# Altium schematic sheet battery-charging.SchDoc
size A
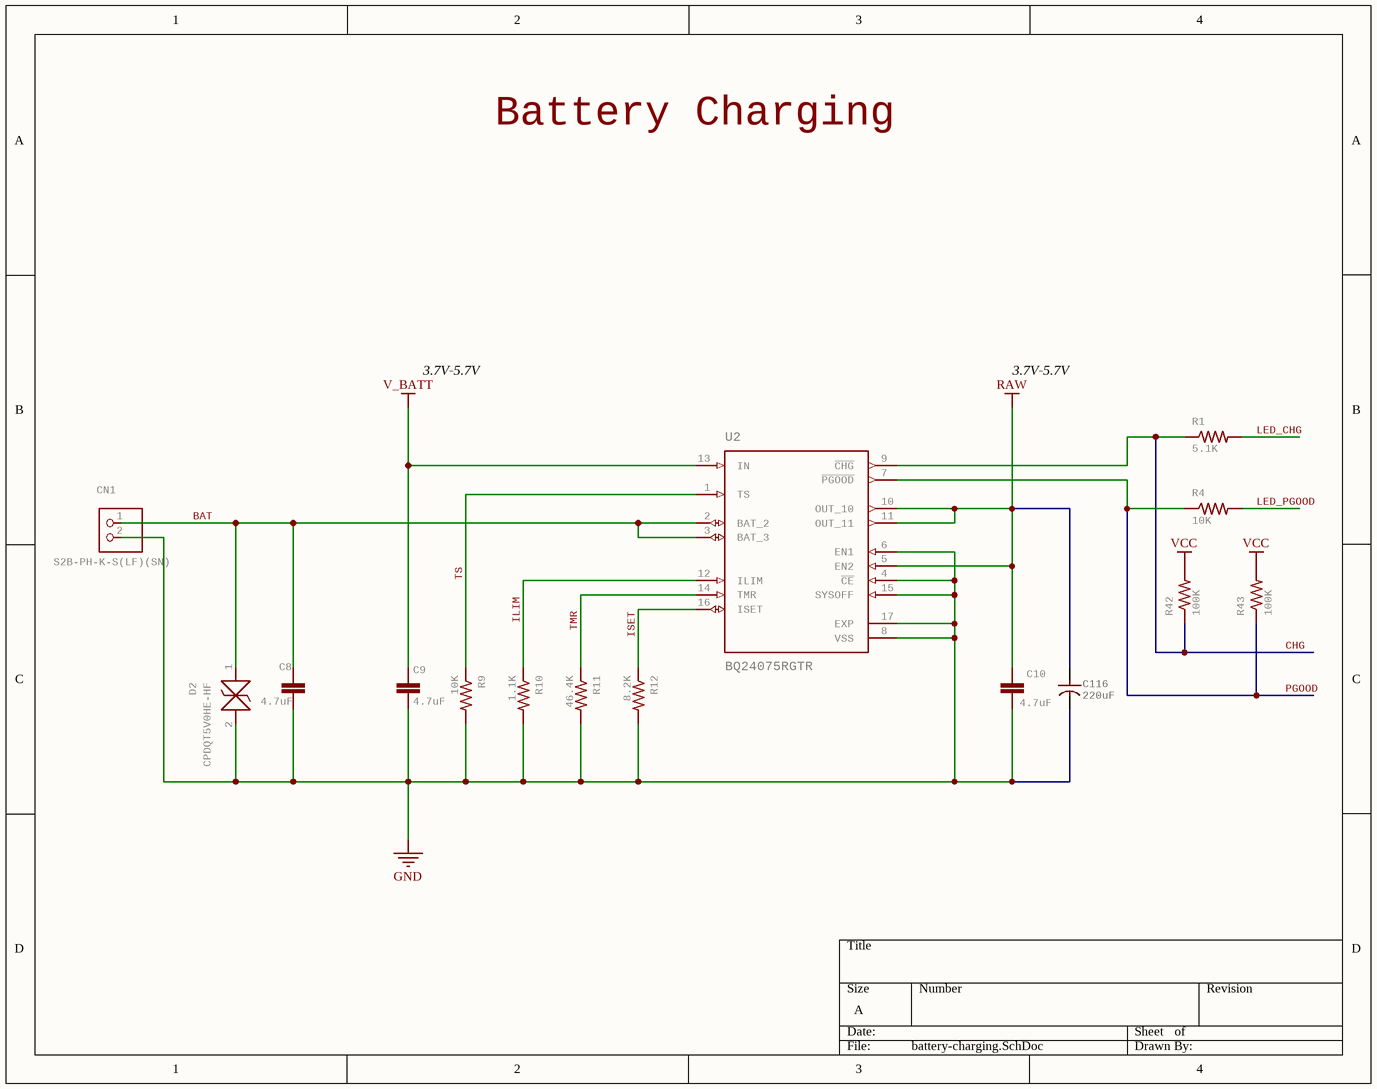
[diagram p0: battery-charging.SchDoc]

## Parts
C8  4.7uF  [0402-CAP]
C9  4.7uF  [0402-CAP]
C10  4.7uF  [0402-CAP]
C116  220uF  [CAP-TANT-1411]
CN1  S2B-PH-K-S(LF)(SN)  [JST-PH-2-THM-RA]
D2  CPDQT5V0HE-HF  [CPDQT5V0HEHF]
R1  5.1K  [0402-RES]
R4  10K  [0402-RES]
R9  10K  [0402-RES]
R10  1.1K  [0402-RES]
R11  46.4K  [0402-RES]
R12  8.2K  [0402-RES]
R42  100K  [0402-RES]
R43  100K  [0402-RES]
U2  BQ24075RGTR  [QFN50P300X300X100-17N]

## Nets
GND: C8.1 C9.1 C10.1 C116.2 CN1.2 D2.2 R9.2 R10.2 R11.2 R12.2 U2.4(~{CE}) U2.6(EN1) U2.8(VSS) U2.15(SYSOFF) U2.17(EXP)
RAW: C10.2 C116.1 U2.5(EN2) U2.10(OUT_10) U2.11(OUT_11)
V_BATT: C9.2 U2.13(IN)
VCC: R42.2 R43.2
BAT: C8.2 CN1.1 D2.1 U2.2(BAT_2) U2.3(BAT_3)
CHG: R1.1 R42.1 U2.9(~{CHG})
ILIM: R10.1 U2.12(ILIM)
ISET: R12.1 U2.16(ISET)
LED_CHG: R1.2
LED_PGOOD: R4.2
PGOOD: R4.1 R43.1 U2.7(~{PGOOD})
TMR: R11.1 U2.14(TMR)
TS: R9.1 U2.1(TS)

## Notes on the sheet
- Battery Charging
- 3.7V-5.7V

## Library data of the parts
C8-C10 = CAP0402-CAP: CapacitorStandard 0603 ceramic capacitor, and 0.1" leaded capacitor.; MPN: JMK105BBJ475MV-F; GateName_1: G$1; SymbolName_1: CAP; DeviceName: 0402-CAP; LibraryName: sfe; DeviceSetName: CAP; Part Number: JMK105BBJ475MV-F
C116 = CAP_POL: MANUFACTURER P/N: F930J227MBA; Part Number: F930J227MBA; DISTRIBUTOR: *; DISTRIBUTOR P/N: *; Value: 220uF; Parameter 1: *; MPN: F930J227MBA
CN1 = JST_2PIN-THM-RA: JST 2-Pin Connectors of various flavors SMT-RA (S2B-PH-SM4) 4UConnector #17311  SMT  (B2B-PH-SM4)  THM-RA (S2B-PH)  THM  (B2B-PH); GateName_1: G$1; SymbolName_1: PINHD2; DeviceName: -THM-RA; LibraryName: adafruit-updated; DeviceSetName: JST_2PIN; MPN: S2B-PH-K-S(LF)(SN); Part Number: S2B-PH-K-S(LF)(SN)
D2 = CPDQT5V0HE-HF: ESD Suppressors / TVS Diodes DIODE ESD 5VWM 65W 0402/SOD-923F   Source:  Datasheet; MANUFACTURER_NAME: Comchip Technology; GateName_1: G$1; SymbolName_1: CPDQT5V0HE-HF; LibraryName: CPDQT5V0HE-HF; DeviceSetName: CPDQT5V0HE-HF; HEIGHT: 0.42mm; MANUFACTURER_PART_NUMBER: CPDQT5V0HE-HF; MOUSER_PART_NUMBER: MOUSER_PART_NUMBER; MOUSER_PRICE-STOCK: MOUSER_PRICE-STOCK; MPN: CPDQT5V0HE-HF; Part Number: CPDQT5V0HE-HF
R1 = RESISTOR0402-RES: ResistorBasic schematic elements and footprints for 0603, 1206, and PTH resistors.; MPN: RC0402JR-075K1L; GateName_1: G$1; SymbolName_1: RESISTOR; DeviceName: 0402-RES; LibraryName: sfe; DeviceSetName: RESISTOR; Part Number: RC0402JR-075K1L
R4 R9 = RESISTOR0402-RES: ResistorBasic schematic elements and footprints for 0603, 1206, and PTH resistors.; MPN: AC0402FR-1310KL; GateName_1: G$1; SymbolName_1: RESISTOR; DeviceName: 0402-RES; LibraryName: sfe; DeviceSetName: RESISTOR; Part Number: AC0402FR-1310KL
R10 = RESISTOR0402-RES: ResistorBasic schematic elements and footprints for 0603, 1206, and PTH resistors.; MPN: RC0402JR-071K1; GateName_1: G$1; SymbolName_1: RESISTOR; DeviceName: 0402-RES; LibraryName: sfe; DeviceSetName: RESISTOR; Part Number: RC0402JR-071K1
R11 = RESISTOR0402-RES: ResistorBasic schematic elements and footprints for 0603, 1206, and PTH resistors.; MPN: WR04X4642FTL; GateName_1: G$1; SymbolName_1: RESISTOR; DeviceName: 0402-RES; LibraryName: sfe; DeviceSetName: RESISTOR; Part Number: WR04X4642FTL
R12 = RESISTOR0402-RES: ResistorBasic schematic elements and footprints for 0603, 1206, and PTH resistors.; MPN: CR0402-FX-8201GLF; GateName_1: G$1; SymbolName_1: RESISTOR; DeviceName: 0402-RES; LibraryName: sfe; DeviceSetName: RESISTOR; Part Number: CR0402-FX-8201GLF
R42 R43 = RESISTOR0402-RES: ResistorBasic schematic elements and footprints for 0603, 1206, and PTH resistors.; MPN: AC0402FR-07100KL; GateName_1: G$1; SymbolName_1: RESISTOR; DeviceName: 0402-RES; LibraryName: sfe; DeviceSetName: RESISTOR; Part Number: AC0402FR-07100KL
U2 = BQ24075RGTR: Standalone 1-cell 1.5-A linear charger, Power Path, 4.2-V VBAT and 5.5-V VOUT 16-VQFN -40 to 85  Check availability; GateName_1: G$1; MF: Texas Instruments; SymbolName_1: BQ24075RGTR; LibraryName: BQ24075RGTR; DeviceSetName: BQ24075RGTR; AVAILABILITY: In Stock; MP: BQ24075RGTR; MPN: BQ24075RGTR; PACKAGE: VQFN-16 Texas Instruments; PRICE: None; PURCHASE-URL: https://pricing.snapeda.com/search/part/BQ24075RGTR/?ref=eda; Part Number: BQ24075RGTR